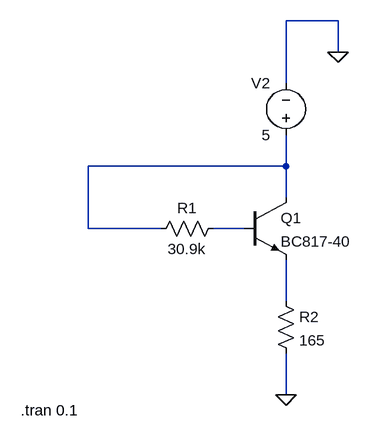
[diagram p0: schematic source.asc]
source.asc, the LTspice schematic file:
Version 4
SHEET 1 880 680
WIRE 336 -128 256 -128
WIRE 336 -80 336 -128
WIRE 256 -32 256 -128
WIRE 256 96 256 48
WIRE 256 96 -48 96
WIRE 256 144 256 96
WIRE -48 192 -48 96
WIRE 64 192 -48 192
WIRE 192 192 144 192
WIRE 256 304 256 240
WIRE 256 448 256 384
FLAG 336 -80 0
FLAG 256 448 0
SYMBOL npn 192 144 R0
SYMATTR InstName Q1
SYMATTR Value BC817-40
SYMBOL res 160 176 R90
WINDOW 0 0 56 VBottom 2
WINDOW 3 32 56 VTop 2
SYMATTR InstName R1
SYMATTR Value 30.9k
SYMATTR SpiceLine tol=1 pwr=0.25
SYMBOL res 240 288 R0
SYMATTR InstName R2
SYMATTR Value 165
SYMATTR SpiceLine tol=1 pwr=0.25
SYMBOL voltage 256 64 R180
WINDOW 0 24 96 Left 2
WINDOW 3 24 16 Left 2
WINDOW 123 0 0 Left 0
WINDOW 39 0 0 Left 0
SYMATTR InstName V2
SYMATTR Value 5
TEXT -152 472 Left 2 !.tran 0.1

The netlist it stands for:
* source.asc
Q1 N001 N002 N003 0 BC817-40
R1 N002 N001 30.9k tol=1 pwr=0.25
R2 N003 0 165 tol=1 pwr=0.25
V2 N001 0 5
.model NPN NPN
.model PNP PNP
.lib standard.bjt
.tran 0.1
.backanno
.end